# Altium project AMC_FMC_Carrier v4.PrjPcb (part 12 of 18)

## Sheet M-LVDS PHY.SchDoc: AMC FMC Carrier v4
size 420 x 297 mm; CompanyName: WUT; Organization: WUT ISE; Address1: Warsaw Univeristy of Technology; Address2: Nowowiejska 15/19 00-665 Warsaw; Address3: t.przywozki@gmail.com; Revision: 1; SheetNumber: 21; SheetTotal: 29; Project: AMC FMC Carrier v4; ModifiedBy: -; CheckedDate: -; Title2: M-LVDS PHY; DivGrp: ISE; Designer: T. Przywozki; ModifiedDate: -; ProjectName: ADC/DAC MEZZANINE
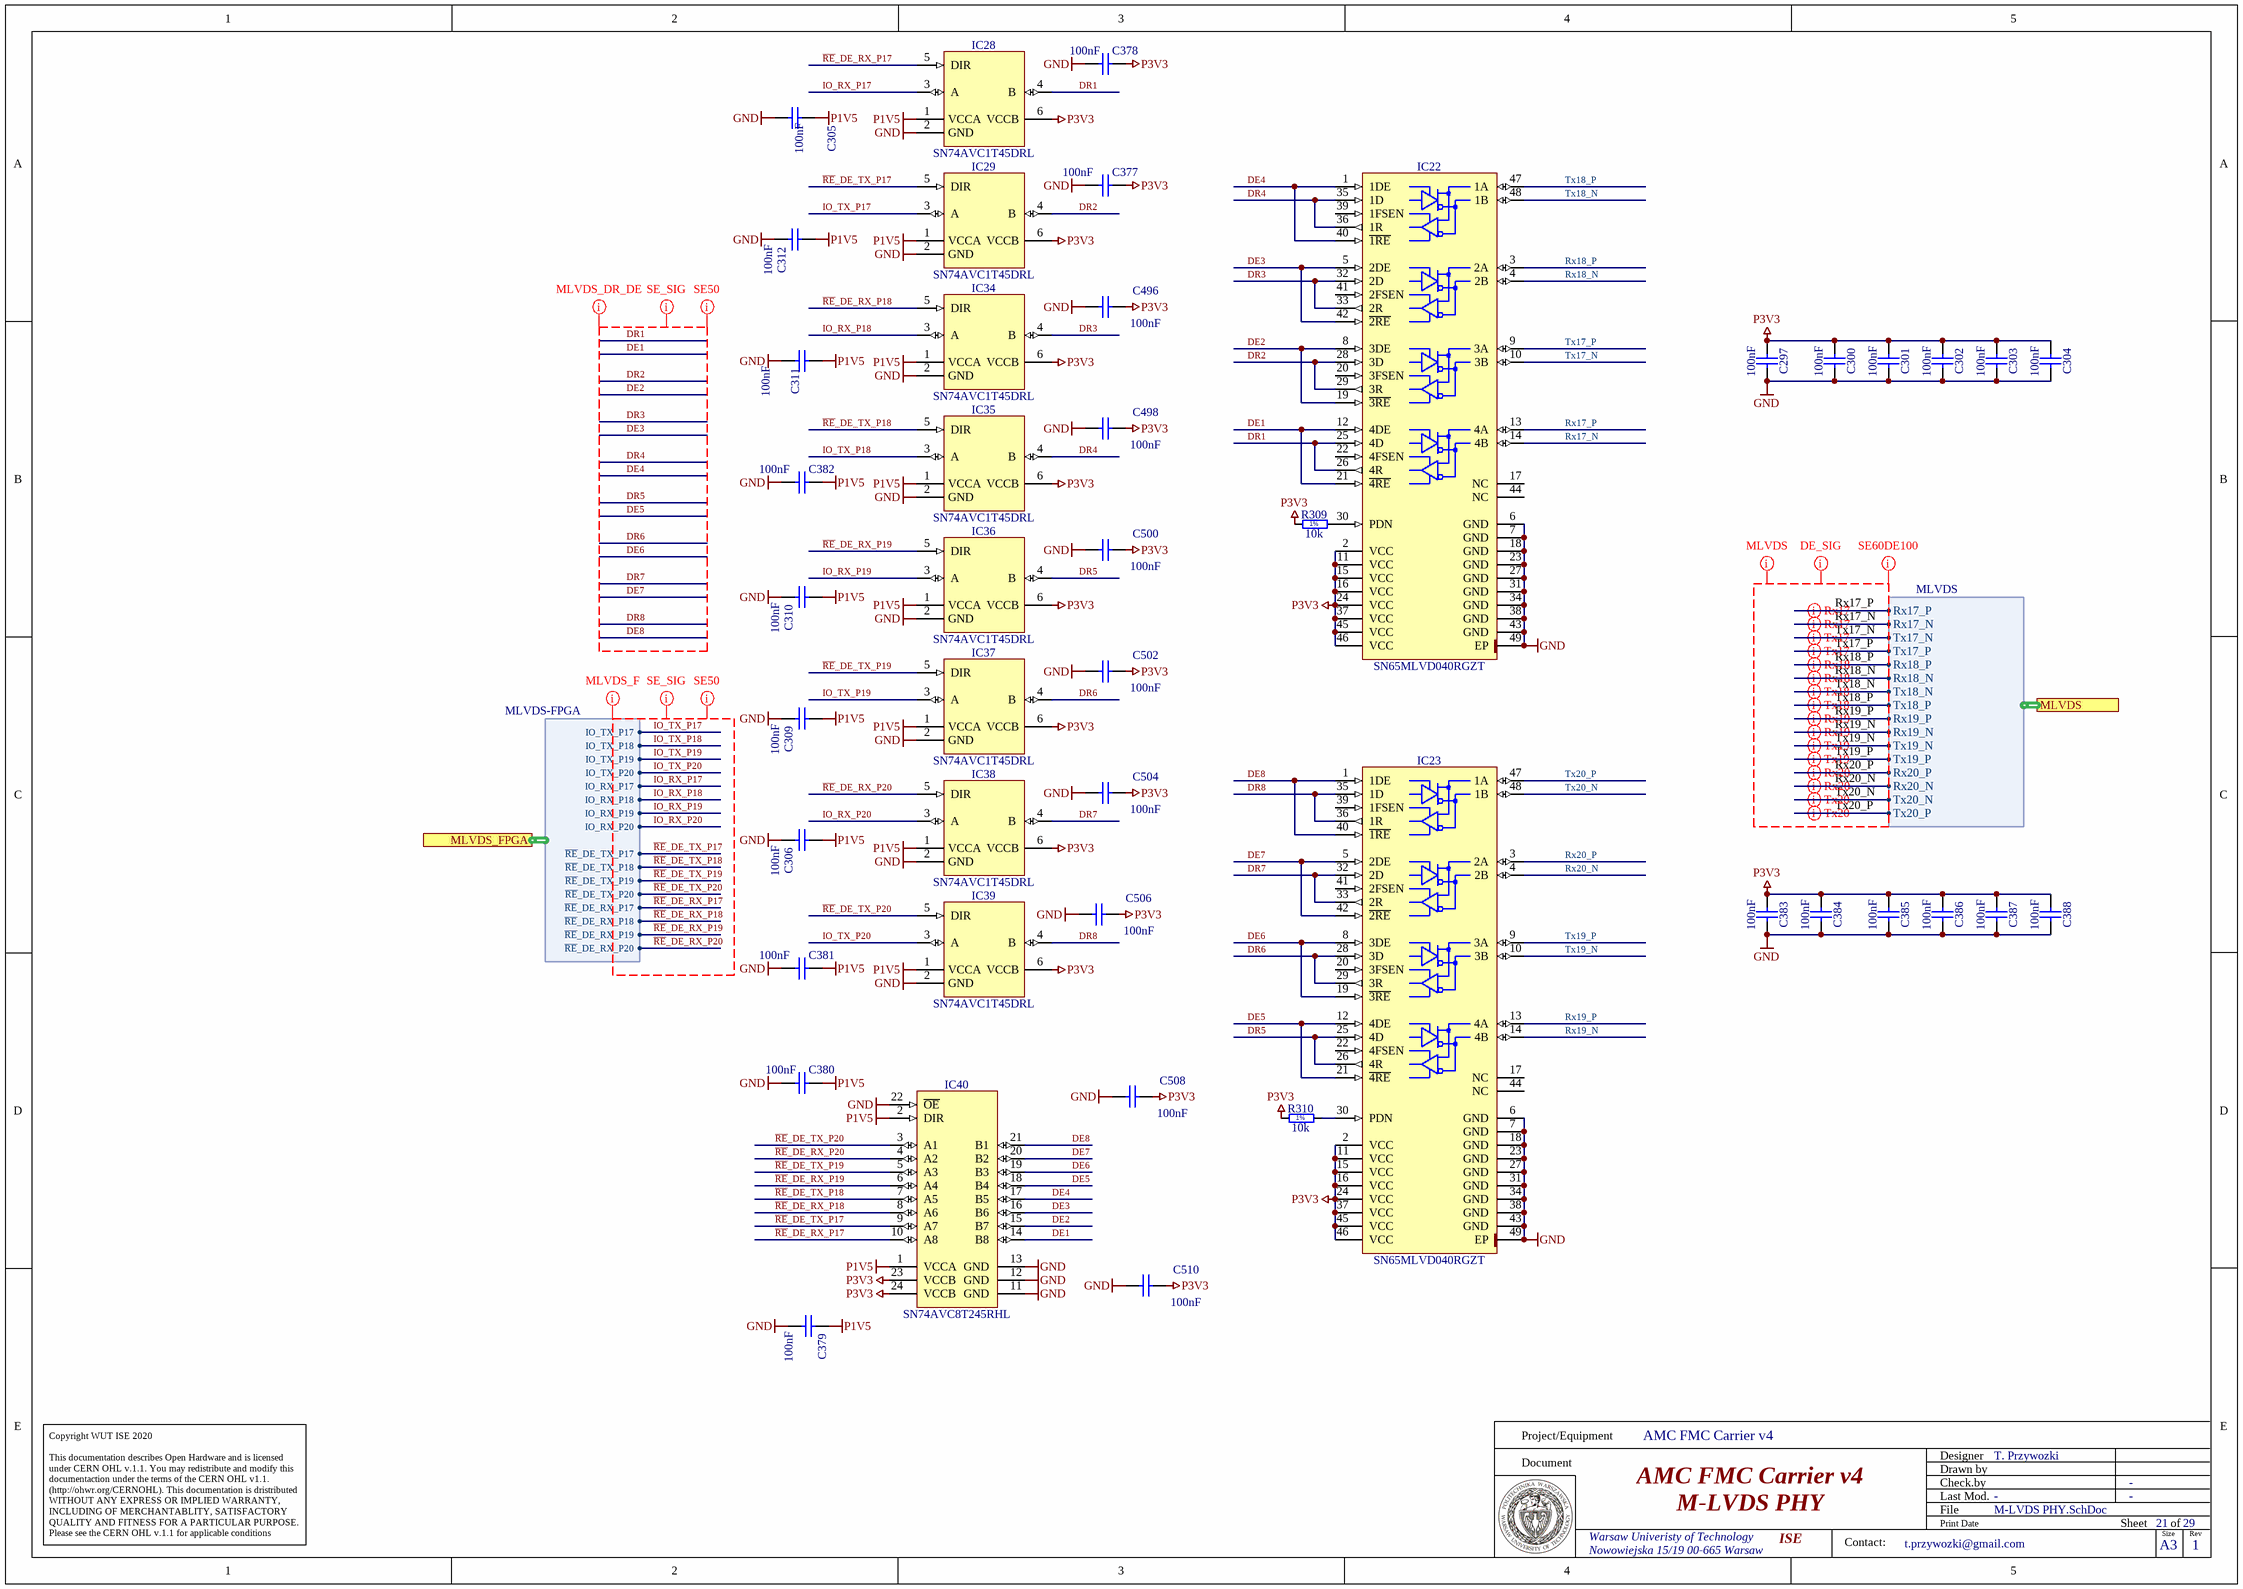
[diagram p22: M-LVDS PHY.SchDoc]

### Parts
C297  100nF  [CAPC0603X33N]
C300  100nF  [CAPC0603X33N]
C301  100nF  [CAPC0603X33N]
C302  100nF  [CAPC0603X33N]
C303  100nF  [CAPC0603X33N]
C304  100nF  [CAPC0603X33N]
C305  100nF  [CAPC0603X33N]
C306  100nF  [CAPC0603X33N]
C309  100nF  [CAPC0603X33N]
C310  100nF  [CAPC0603X33N]
C311  100nF  [CAPC0603X33N]
C312  100nF  [CAPC0603X33N]
C377  100nF  [CAPC0603X33N]
C378  100nF  [CAPC0603X33N]
C379  100nF  [CAPC0603X33N]
C380  100nF  [CAPC0603X33N]
C381  100nF  [CAPC0603X33N]
C382  100nF  [CAPC0603X33N]
C383  100nF  [CAPC0603X33N]
C384  100nF  [CAPC0603X33N]
C385  100nF  [CAPC0603X33N]
C386  100nF  [CAPC0603X33N]
C387  100nF  [CAPC0603X33N]
C388  100nF  [CAPC0603X33N]
C496  100nF  [CAPC0603X33N]
C498  100nF  [CAPC0603X33N]
C500  100nF  [CAPC0603X33N]
C502  100nF  [CAPC0603X33N]
C504  100nF  [CAPC0603X33N]
C506  100nF  [CAPC0603X33N]
C508  100nF  [CAPC0603X33N]
C510  100nF  [CAPC0603X33N]
IC22  SN65MLVD040RGZT  [QFN50P700X700X100-49N-S420]
IC23  SN65MLVD040RGZT  [QFN50P700X700X100-49N-S420]
IC28  SN74AVC1T45DRL  [SOTFL50P160X60-6N]
IC29  SN74AVC1T45DRL  [SOTFL50P160X60-6N]
IC34  SN74AVC1T45DRL  [SOTFL50P160X60-6N]
IC35  SN74AVC1T45DRL  [SOTFL50P160X60-6N]
IC36  SN74AVC1T45DRL  [SOTFL50P160X60-6N]
IC37  SN74AVC1T45DRL  [SOTFL50P160X60-6N]
IC38  SN74AVC1T45DRL  [SOTFL50P160X60-6N]
IC39  SN74AVC1T45DRL  [SOTFL50P160X60-6N]
IC40  SN74AVC8T245RHL  [TEXAS_RHL (S-PVQFN-N24)]
R309  10k  [RESC1005X40N]
R310  10k  [RESC1005X40N]

### Ports
MLVDS (harness MLVDS), MLVDS_FPGA (harness MLVDS-FPGA)

### Harnesses
MLVDS: Rx17_P, Rx17_N, Tx17_N, Tx17_P, Rx18_P, Rx18_N, Tx18_N, Tx18_P, Rx19_P, Rx19_N, Tx19_N, Tx19_P, Rx20_P, Rx20_N, Tx20_N, Tx20_P
MLVDS-FPGA: IO_TX_P17, IO_TX_P18, IO_TX_P19, IO_TX_P20, IO_RX_P17, IO_RX_P18, IO_RX_P19, IO_RX_P20, ~{RE}_DE_TX_P17, ~{RE}_DE_TX_P18, ~{RE}_DE_TX_P19, ~{RE}_DE_TX_P20, ~{RE}_DE_RX_P17, ~{RE}_DE_RX_P18, ~{RE}_DE_RX_P19, ~{RE}_DE_RX_P20

### Nets
GND: C297.2 C300.2 C301.2 C302.2 C303.2 C304.2 C305.2 C306.1 C309.1 C310.1 C311.1 C312.1 C377.1 C378.1 C379.1 C380.1 C381.1 C382.1 C383.2 C384.2 C385.2 C386.2 C387.2 C388.2 C496.2 C498.2 C500.2 C502.2 C504.2 C506.2 C508.2 C510.2 IC22.6(GND) IC22.7(GND) IC22.18(GND) IC22.23(GND) IC22.27(GND) IC22.31(GND) IC22.34(GND) IC22.38(GND) IC22.43(GND) IC22.49(EP) IC23.6(GND) IC23.7(GND) IC23.18(GND) IC23.23(GND) IC23.27(GND) IC23.31(GND) IC23.34(GND) IC23.38(GND) IC23.43(GND) IC23.49(EP) IC28.2(GND) IC29.2(GND) IC34.2(GND) IC35.2(GND) IC36.2(GND) IC37.2(GND) IC38.2(GND) IC39.2(GND) IC40.11(GND) IC40.12(GND) IC40.13(GND) IC40.22(~{OE})
P1V5: C305.1 C306.2 C309.2 C310.2 C311.2 C312.2 C379.2 C380.2 C381.2 C382.2 IC28.1(VCCA) IC29.1(VCCA) IC34.1(VCCA) IC35.1(VCCA) IC36.1(VCCA) IC37.1(VCCA) IC38.1(VCCA) IC39.1(VCCA) IC40.1(VCCA) IC40.2(DIR)
P3V3: C297.1 C300.1 C301.1 C302.1 C303.1 C304.1 C377.2 C378.2 C383.1 C384.1 C385.1 C386.1 C387.1 C388.1 C496.1 C498.1 C500.1 C502.1 C504.1 C506.1 C508.1 C510.1 IC22.2(VCC) IC22.11(VCC) IC22.15(VCC) IC22.16(VCC) IC22.24(VCC) IC22.37(VCC) IC22.45(VCC) IC22.46(VCC) IC23.2(VCC) IC23.11(VCC) IC23.15(VCC) IC23.16(VCC) IC23.24(VCC) IC23.37(VCC) IC23.45(VCC) IC23.46(VCC) IC28.6(VCCB) IC29.6(VCCB) IC34.6(VCCB) IC35.6(VCCB) IC36.6(VCCB) IC37.6(VCCB) IC38.6(VCCB) IC39.6(VCCB) IC40.23(VCCB) IC40.24(VCCB) R309.1 R310.1
DE1: IC22.12(4DE) IC22.21(~{4RE}) IC40.14(B8)
DE2: IC22.8(3DE) IC22.19(~{3RE}) IC40.15(B7)
DE3: IC22.5(2DE) IC22.42(~{2RE}) IC40.16(B6)
DE4: IC22.1(1DE) IC22.40(~{1RE}) IC40.17(B5)
DE5: IC23.12(4DE) IC23.21(~{4RE}) IC40.18(B4)
DE6: IC23.8(3DE) IC23.19(~{3RE}) IC40.19(B3)
DE7: IC23.5(2DE) IC23.42(~{2RE}) IC40.20(B2)
DE8: IC23.1(1DE) IC23.40(~{1RE}) IC40.21(B1)
DR1: IC22.25(4D) IC22.26(4R) IC28.4(B)
DR2: IC22.28(3D) IC22.29(3R) IC29.4(B)
DR3: IC22.32(2D) IC22.33(2R) IC34.4(B)
DR4: IC22.35(1D) IC22.36(1R) IC35.4(B)
DR5: IC23.25(4D) IC23.26(4R) IC36.4(B)
DR6: IC23.28(3D) IC23.29(3R) IC37.4(B)
DR7: IC23.32(2D) IC23.33(2R) IC38.4(B)
DR8: IC23.35(1D) IC23.36(1R) IC39.4(B)
IO_RX_P17: IC28.3(A) ; port MLVDS_FPGA.IO_RX_P17  [project net MLVDS_F.IO_RX_P17]
IO_RX_P18: IC34.3(A) ; port MLVDS_FPGA.IO_RX_P18  [project net MLVDS_F.IO_RX_P18]
IO_RX_P19: IC36.3(A) ; port MLVDS_FPGA.IO_RX_P19  [project net MLVDS_F.IO_RX_P19]
IO_RX_P20: IC38.3(A) ; port MLVDS_FPGA.IO_RX_P20  [project net MLVDS_F.IO_RX_P20]
IO_TX_P17: IC29.3(A) ; port MLVDS_FPGA.IO_TX_P17  [project net MLVDS_F.IO_TX_P17]
IO_TX_P18: IC35.3(A) ; port MLVDS_FPGA.IO_TX_P18  [project net MLVDS_F.IO_TX_P18]
IO_TX_P19: IC37.3(A) ; port MLVDS_FPGA.IO_TX_P19  [project net MLVDS_F.IO_TX_P19]
IO_TX_P20: IC39.3(A) ; port MLVDS_FPGA.IO_TX_P20  [project net MLVDS_F.IO_TX_P20]
~{RE}_DE_RX_P17: IC28.5(DIR) IC40.10(A8) ; port MLVDS_FPGA.~{RE}_DE_RX_P17  [project net MLVDS_F.~{RE}_DE_RX_P17]
~{RE}_DE_RX_P18: IC34.5(DIR) IC40.8(A6) ; port MLVDS_FPGA.~{RE}_DE_RX_P18  [project net MLVDS_F.~{RE}_DE_RX_P18]
~{RE}_DE_RX_P19: IC36.5(DIR) IC40.6(A4) ; port MLVDS_FPGA.~{RE}_DE_RX_P19  [project net MLVDS_F.~{RE}_DE_RX_P19]
~{RE}_DE_RX_P20: IC38.5(DIR) IC40.4(A2) ; port MLVDS_FPGA.~{RE}_DE_RX_P20  [project net MLVDS_F.~{RE}_DE_RX_P20]
~{RE}_DE_TX_P17: IC29.5(DIR) IC40.9(A7) ; port MLVDS_FPGA.~{RE}_DE_TX_P17  [project net MLVDS_F.~{RE}_DE_TX_P17]
~{RE}_DE_TX_P18: IC35.5(DIR) IC40.7(A5) ; port MLVDS_FPGA.~{RE}_DE_TX_P18  [project net MLVDS_F.~{RE}_DE_TX_P18]
~{RE}_DE_TX_P19: IC37.5(DIR) IC40.5(A3) ; port MLVDS_FPGA.~{RE}_DE_TX_P19  [project net MLVDS_F.~{RE}_DE_TX_P19]
~{RE}_DE_TX_P20: IC39.5(DIR) IC40.3(A1) ; port MLVDS_FPGA.~{RE}_DE_TX_P20  [project net MLVDS_F.~{RE}_DE_TX_P20]
Rx17_N: IC22.14(4B) ; port MLVDS.Rx17_N  [project net MLVDS_A.Rx17_N]
Rx17_P: IC22.13(4A) ; port MLVDS.Rx17_P  [project net MLVDS_A.Rx17_P]
Rx18_N: IC22.4(2B) ; port MLVDS.Rx18_N  [project net MLVDS_A.Rx18_N]
Rx18_P: IC22.3(2A) ; port MLVDS.Rx18_P  [project net MLVDS_A.Rx18_P]
Rx19_N: IC23.14(4B) ; port MLVDS.Rx19_N  [project net MLVDS_A.Rx19_N]
Rx19_P: IC23.13(4A) ; port MLVDS.Rx19_P  [project net MLVDS_A.Rx19_P]
Rx20_N: IC23.4(2B) ; port MLVDS.Rx20_N  [project net MLVDS_A.Rx20_N]
Rx20_P: IC23.3(2A) ; port MLVDS.Rx20_P  [project net MLVDS_A.Rx20_P]
Tx17_N: IC22.10(3B) ; port MLVDS.Tx17_N  [project net MLVDS_A.Tx17_N]
Tx17_P: IC22.9(3A) ; port MLVDS.Tx17_P  [project net MLVDS_A.Tx17_P]
Tx18_N: IC22.48(1B) ; port MLVDS.Tx18_N  [project net MLVDS_A.Tx18_N]
Tx18_P: IC22.47(1A) ; port MLVDS.Tx18_P  [project net MLVDS_A.Tx18_P]
Tx19_N: IC23.10(3B) ; port MLVDS.Tx19_N  [project net MLVDS_A.Tx19_N]
Tx19_P: IC23.9(3A) ; port MLVDS.Tx19_P  [project net MLVDS_A.Tx19_P]
Tx20_N: IC23.48(1B) ; port MLVDS.Tx20_N  [project net MLVDS_A.Tx20_N]
Tx20_P: IC23.47(1A) ; port MLVDS.Tx20_P  [project net MLVDS_A.Tx20_P]
NetIC22_30: IC22.30(PDN) R309.2
NetIC23_30: IC23.30(PDN) R310.2

Not connected (* = marked no-connect by the designer): IC22 17(NC) 20(3FSEN) 22(4FSEN) 39(1FSEN) 41(2FSEN) 44(NC); IC23 17(NC) 20(3FSEN) 22(4FSEN) 39(1FSEN) 41(2FSEN) 44(NC)

### Layout directives
differential pair: MLVDS_A.Rx17_N, MLVDS_A.Rx17_P, MLVDS_A.Rx18_N, MLVDS_A.Rx18_P, MLVDS_A.Rx19_N, MLVDS_A.Rx19_P, MLVDS_A.Rx20_N, MLVDS_A.Rx20_P, MLVDS_A.Tx17_N, MLVDS_A.Tx17_P, MLVDS_A.Tx18_N, MLVDS_A.Tx18_P, MLVDS_A.Tx19_N, MLVDS_A.Tx19_P, MLVDS_A.Tx20_N, MLVDS_A.Tx20_P
net class MLVDS: Rx17_N, Rx17_P, Rx18_N, Rx18_P, Rx19_N, Rx19_P, Rx20_N, Rx20_P, Tx17_N, Tx17_P, Tx18_N, Tx18_P, Tx19_N, Tx19_P, Tx20_N, Tx20_P
net class DE_SIG: Rx17_N, Rx17_P, Rx18_N, Rx18_P, Rx19_N, Rx19_P, Rx20_N, Rx20_P, Tx17_N, Tx17_P, Tx18_N, Tx18_P, Tx19_N, Tx19_P, Tx20_N, Tx20_P
net class SE60DE100: Rx17_N, Rx17_P, Rx18_N, Rx18_P, Rx19_N, Rx19_P, Rx20_N, Rx20_P, Tx17_N, Tx17_P, Tx18_N, Tx18_P, Tx19_N, Tx19_P, Tx20_N, Tx20_P
net class MLVDS_F: IO_RX_P17, IO_RX_P18, IO_RX_P19, IO_RX_P20, IO_TX_P17, IO_TX_P18, IO_TX_P19, IO_TX_P20, ~{RE}_DE_RX_P17, ~{RE}_DE_RX_P18, ~{RE}_DE_RX_P19, ~{RE}_DE_RX_P20, ~{RE}_DE_TX_P17, ~{RE}_DE_TX_P18, ~{RE}_DE_TX_P19, ~{RE}_DE_TX_P20
net class SE50: DE1, DE2, DE3, DE4, DE5, DE6, DE7, DE8, DR1, DR2, DR3, DR4, DR5, DR6, DR7, DR8, IO_RX_P17, IO_RX_P18, IO_RX_P19, IO_RX_P20, IO_TX_P17, IO_TX_P18, IO_TX_P19, IO_TX_P20, ~{RE}_DE_RX_P17, ~{RE}_DE_RX_P18, ~{RE}_DE_RX_P19, ~{RE}_DE_RX_P20, ~{RE}_DE_TX_P17, ~{RE}_DE_TX_P18, ~{RE}_DE_TX_P19, ~{RE}_DE_TX_P20
net class SE_SIG: DE1, DE2, DE3, DE4, DE5, DE6, DE7, DE8, DR1, DR2, DR3, DR4, DR5, DR6, DR7, DR8, IO_RX_P17, IO_RX_P18, IO_RX_P19, IO_RX_P20, IO_TX_P17, IO_TX_P18, IO_TX_P19, IO_TX_P20, ~{RE}_DE_RX_P17, ~{RE}_DE_RX_P18, ~{RE}_DE_RX_P19, ~{RE}_DE_RX_P20, ~{RE}_DE_TX_P17, ~{RE}_DE_TX_P18, ~{RE}_DE_TX_P19, ~{RE}_DE_TX_P20
net class MLVDS_DR_DE: DE1, DE2, DE3, DE4, DE5, DE6, DE7, DE8, DR1, DR2, DR3, DR4, DR5, DR6, DR7, DR8

### Notes on the sheet
- Project/Equipment
- Document
- Designer
- Drawn by
- Check.by
- Copyright WUT ISE 2020
  This documentation describes Open Hardware and is licensed under CERN OHL v.1.1. You may redistribute and modify this documentaction under the terms of the CERN OHL v1.1.
  (http://ohwr.org/CERNOHL). This documentation is dristributed WITHOUT ANY EXPRESS OR IMPLIED WARRANTY, INCLUDING OF MERCHANTABLITY, SATISFACTORY QUALITY AND FITNESS FOR A PARTICULAR PURPOSE. Please see the CERN OHL v.1.1 for applicable conditions
- File
- Last Mod.
- Print Date
- Sheet
- Size
- A3
- of
- Rev
- Contact:
- (in symbol R0402_10K_1%_0.0625W_100PPM) 1%

### Library data of the parts
C297 C300-C306 C309-C312 C377-C388 C496 C498 C500 C502 C504 C506 C508 C510 = CC0201_100NF_6.3V_10%_X5R: as C509 on sheet UI_mon; Part Number: CC0201_100NF_6.3V_10%_X5R; Component Kind: Standard; Component Type: Standard; Pin Count: 2; Value: 100nF; Status: Not Recommended; Manufacturer Part Number: CC0201_100NF_6.3V_10%_X5R; Case: 0201; Mounted: Yes; Socket: No; SMD: Yes; Manufacturer1 Example: AVX; Manufacturer1 ComponentHeight: 0.33mm; HelpURL: \\cern.ch\dfs\Applications\Altium\Datasheets\CC0201_X5R_AVX.pdf; Author: CERN DEM JLC; CreateDate: 2007-12-03; LatestRevisionDate: 2007-12-03
IC22 IC23 = SN65MLVD040RGZT: 4-Channel Half-Duplex M-LVDS Line Transceiver; Manufacturer: TEXAS INSTRUMENTS; PressFit: No; Bonding: No; Part Number: SN65MLVD040RGZT; Component Kind: Standard; Component Type: Standard; Device: SN65MLVD040RGZT; PackageDescription: QFN, 0.50mm Pitch, Square; 48 Pin, 7.00mm L X 7.00mm W X 1.00mm H body (w/Thermal Tab 4.20 X 4.20mm), IPC Medium Density; Part Description: 4-Channel Half-Duplex M-LVDS Line Transceiver; Manufacturer Part Number: SN65MLVD040RGZT; Pin Count: 49; Case: QFN48; Mounted: Yes; Socket: No; SMD: Yes; Sense: No; ComponentHeight: 1mm; Author: CERN DEM JLC; HelpURL: \\cern.ch\dfs\Applications\Altium\Datasheets\SN65MLVD040RGZT.pdf; CreateDate: 17.03.2011; LatestRevisionDate: 17.03.2011
IC28 IC29 IC34-IC39 = SN74AVC1T45DRL: Single-Bit Dual-Supply Bus Transceiver; Part Description: Single-Bit Dual-Supply Bus Transceiver with Configurable Voltage Translation and 3-State Outputs; Manufacturer: TEXAS INSTRUMENTS; PressFit: No; Bonding: No; Part Number: SN74AVC1T45DRL; Component Kind: Standard; Component Type: Standard; Device: SN74AVC1T45DRL; PackageDescription: SOTFL (SOT666), 0.50mm, Pitch; 6 Pin, 1.20mm W X 1.60mm L X 0.60mm H Body, IPC Medium Density; Manufacturer Part Number: SN74AVC1T45DRL; Pin Count: 6; Case: SOT666; Mounted: Yes; Socket: No; SMD: Yes; Sense: No; ComponentHeight: 0.6mm; Author: CERN DEM MR; HelpURL: \\cern.ch\dfs\Applications\Altium\Datasheets\SN74AVC1T45DRL.pdf; CreateDate: 11.11.2016; LatestRevisionDate: 11.11.2016
IC40 = SN74AVC8T245RHL: 8-Bit Dual-Supply Bus Transceiver With Configurable Voltage Translation and 3-State Outputs; Manufacturer: TEXAS INSTRUMENTS; PressFit: No; Bonding: No; Part Number: SN74AVC8T245RHL; Component Kind: Standard; Component Type: Standard; Device: SN74AVC8T245RHL; PackageDescription: TEXAS Case Style RHL (S-PVQFN-N24), QFN, 0.50mm Pitch, Rectangular; 24 Pin, 5.50mm L X 3.50mm W X 1mm H body (w/thermal tab 4.05 X 2.05mm); Part Description: 8-Bit Dual-Supply Bus Transceiver With Configurable Voltage Translation and 3-State Outputs; Manufacturer Part Number: SN74AVC8T245RHL; Pin Count: 25; Case: QFN24; Mounted: Yes; Socket: No; SMD: Yes; Sense: No; ComponentHeight: 1.0mm; Author: CERN DEM MR; HelpURL: \\cern.ch\dfs\Applications\Altium\Datasheets\SN74AVC8T245RHL.pdf; CreateDate: 09.11.2016; LatestRevisionDate: 09.11.2016
R309 R310 = R0402_10K_1%_0.0625W_100PPM: as R164 on sheet JTAG_Configuration; Part Number: R0402_10K_1%_0.0625W_100PPM; Component Kind: Standard; Component Type: Standard; Pin Count: 2; Value: 10k; Status: Not recommended; Power: 0.0625W; Tolerance: ±1%; Manufacturer Part Number: R0402_10K_1%_0.0625W_100PPM; Case: 0402; Mounted: Yes; Socket: No; SMD: Yes; Manufacturer1 Example: YAGEO PHYCOMP; Manufacturer1 ComponentHeight: 0.4mm; HelpURL: \\cern.ch\dfs\Applications\Altium\Datasheets\R0402_Phycomp_RC0402.pdf; Author: CERN DEM JLC; CreateDate: 2007-12-03; LatestRevisionDate: 2012-10-17